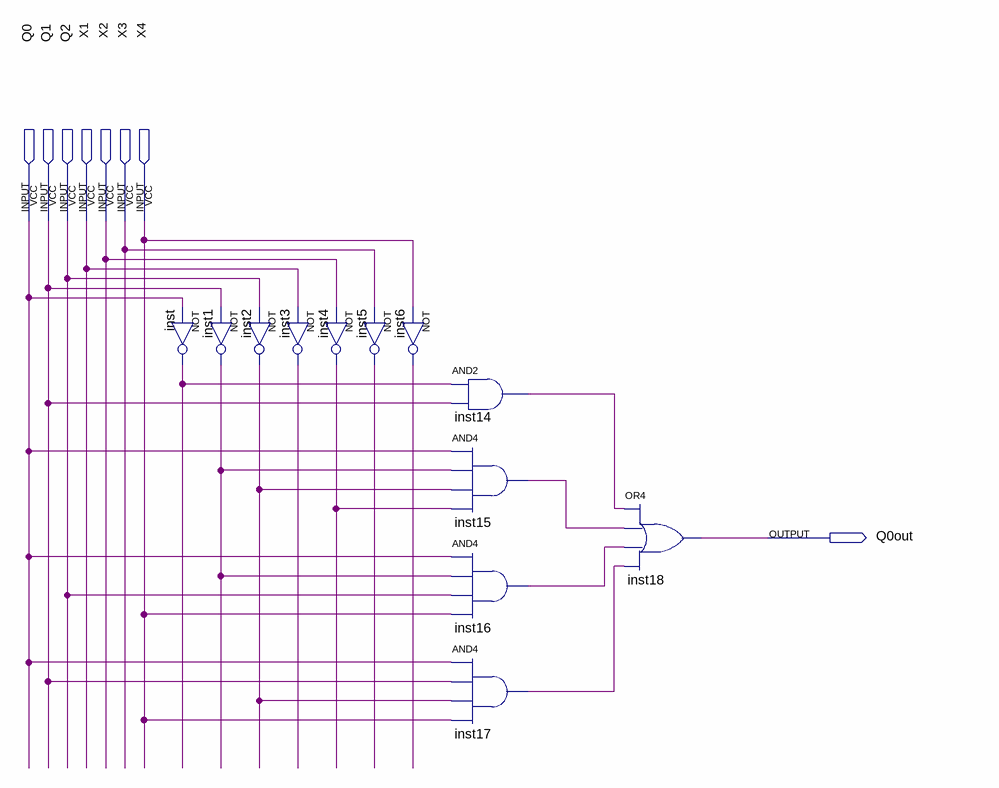
[diagram p0: schematic sheet]
// Quartus schematic Q0.bdf as structural Verilog: 12 symbols, 8 pins
module Q0 (
  input  Q0,
  input  Q1,
  input  Q2,
  input  X1,
  input  X2,
  input  X3,
  input  X4,
  output Q0out
);

  wire inst1_out, inst2_out, inst3_out, inst4_out, inst5_out, inst6_out, inst14_out, inst15_out, inst16_out,
       inst17_out, inst_out;

  not inst (inst_out, Q0);
  not inst1 (inst1_out, Q1);
  not inst2 (inst2_out, Q2);
  not inst3 (inst3_out, X1);
  not inst4 (inst4_out, X2);
  not inst5 (inst5_out, X3);
  not inst6 (inst6_out, X4);
  and inst14 (inst14_out, inst_out, Q1);
  and inst15 (inst15_out, Q0, inst1_out, inst2_out, inst4_out);
  and inst16 (inst16_out, Q0, inst1_out, Q2, X4);
  and inst17 (inst17_out, Q0, Q1, inst2_out, X4);
  or inst18 (Q0out, inst14_out, inst15_out, inst16_out, inst17_out);
endmodule
